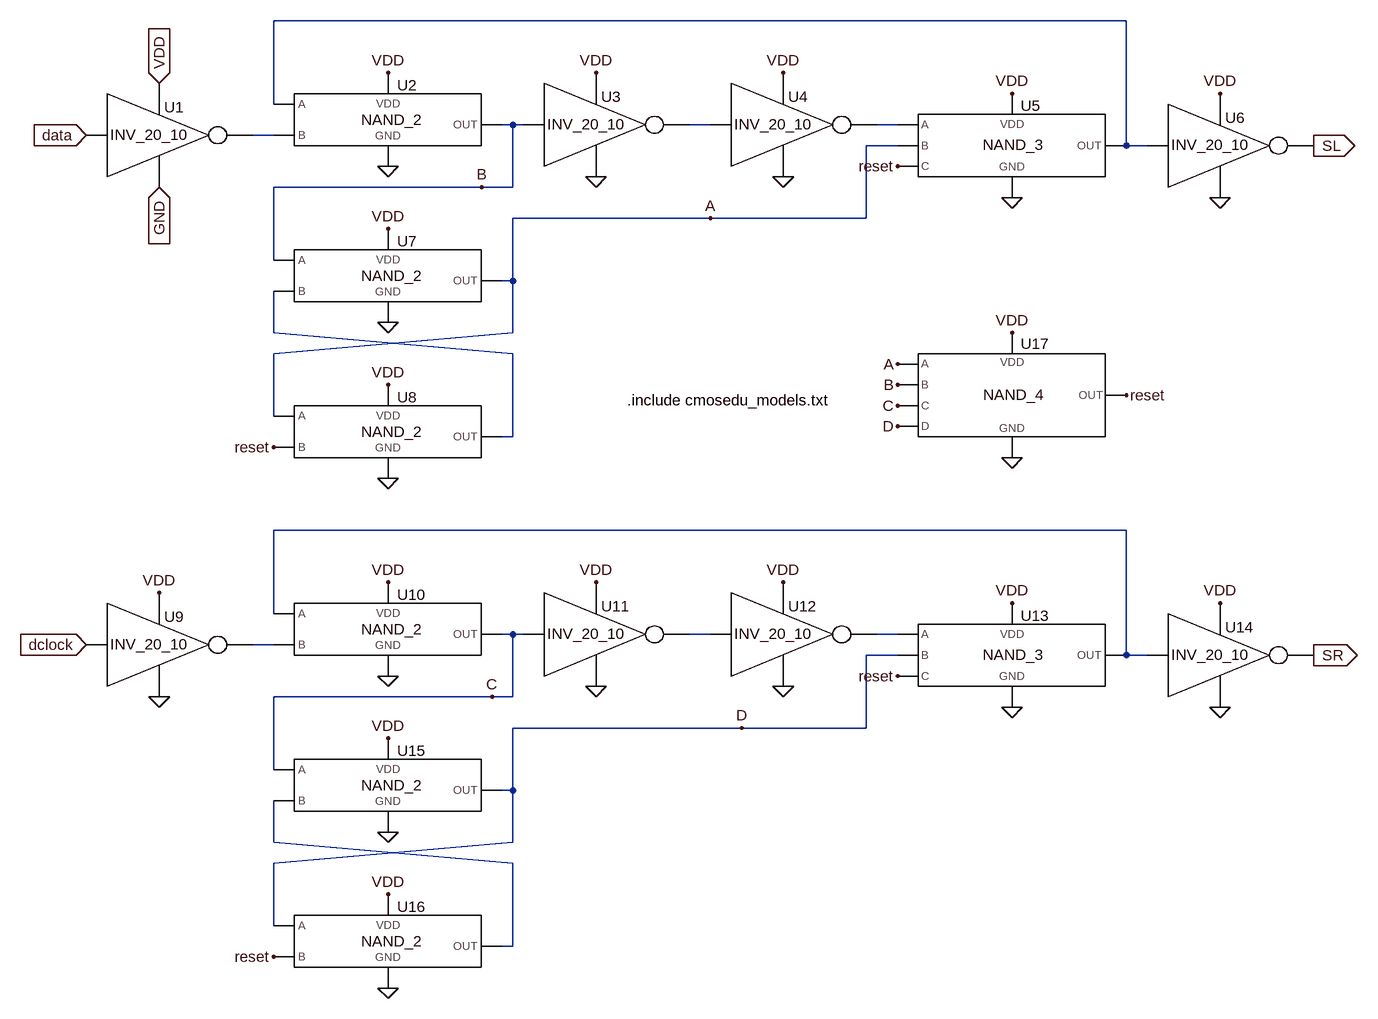
[diagram p0: schematic PD_RSDLL.asc]
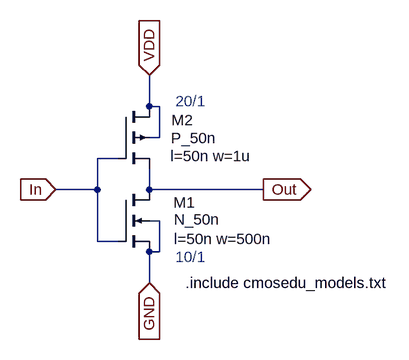
[diagram p1: sub-circuit inv_20_10.asc]
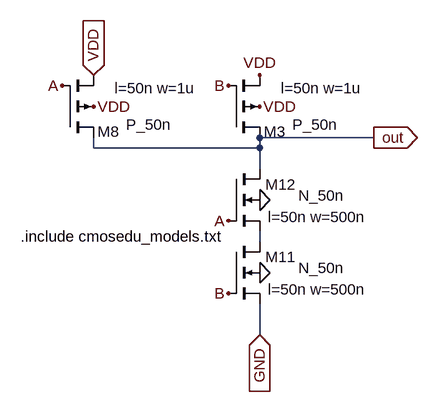
[diagram p2: sub-circuit nand_2.asc]
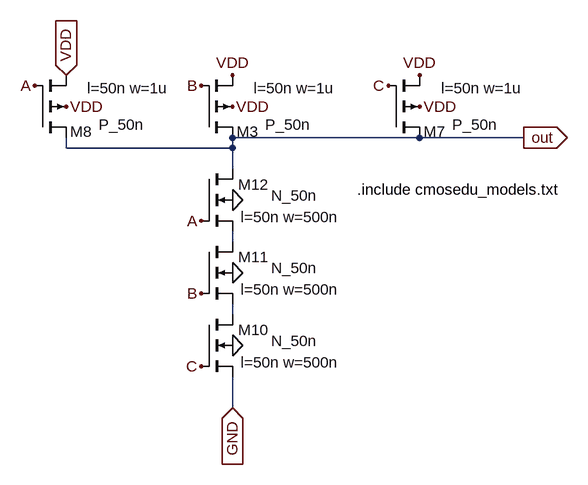
[diagram p3: sub-circuit nand_3.asc]
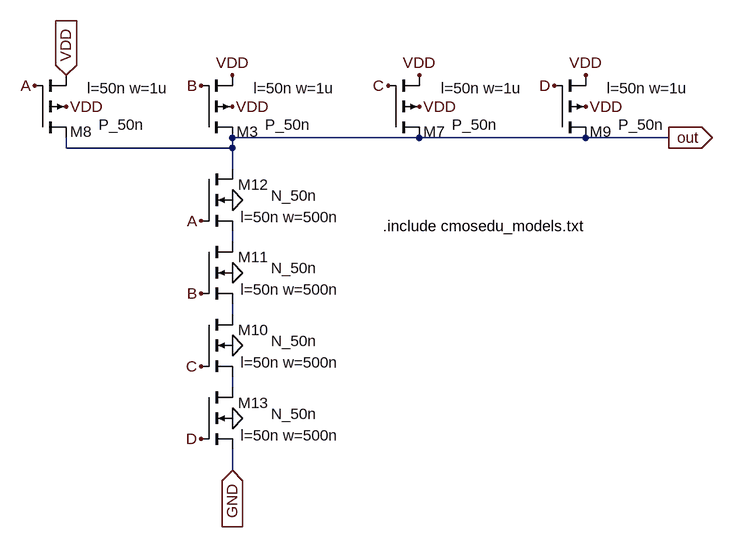
[diagram p4: sub-circuit nand_4.asc]
PD_RSDLL.asc, the LTspice schematic file:
Version 4
SHEET 1 6296 1412
WIRE 2592 -96 1280 -96
WIRE 1280 32 1280 -96
WIRE 1648 64 1632 64
WIRE 1664 64 1648 64
WIRE 1952 64 1920 64
WIRE 2240 64 2208 64
WIRE 1280 80 1248 80
WIRE 2240 96 2192 96
WIRE 2592 96 2592 -96
WIRE 2624 96 2592 96
WIRE 1600 160 1280 160
WIRE 1648 160 1648 64
WIRE 1648 160 1600 160
WIRE 1952 208 1648 208
WIRE 2192 208 2192 96
WIRE 2192 208 1952 208
WIRE 1280 272 1280 160
WIRE 1648 304 1648 208
WIRE 1648 304 1632 304
WIRE 1280 384 1280 320
WIRE 1648 384 1648 304
WIRE 1280 416 1648 384
WIRE 1648 416 1280 384
WIRE 1280 512 1280 416
WIRE 1648 544 1648 416
WIRE 1648 544 1632 544
WIRE 2592 688 1280 688
WIRE 1280 816 1280 688
WIRE 1648 848 1632 848
WIRE 1664 848 1648 848
WIRE 1952 848 1920 848
WIRE 2240 848 2208 848
WIRE 1280 864 1248 864
WIRE 2240 880 2192 880
WIRE 2592 880 2592 688
WIRE 2624 880 2592 880
WIRE 1616 944 1280 944
WIRE 1648 944 1648 848
WIRE 1648 944 1616 944
WIRE 2000 992 1648 992
WIRE 2192 992 2192 880
WIRE 2192 992 2000 992
WIRE 1280 1056 1280 944
WIRE 1648 1088 1648 992
WIRE 1648 1088 1632 1088
WIRE 1280 1168 1280 1104
WIRE 1648 1168 1648 1088
WIRE 1280 1200 1648 1168
WIRE 1648 1200 1280 1168
WIRE 1280 1296 1280 1200
WIRE 1648 1328 1648 1200
WIRE 1648 1328 1632 1328
FLAG 1104 0 VDD
IOPIN 1104 0 In
FLAG 992 80 data
IOPIN 992 80 In
FLAG 1456 -16 VDD
FLAG 1456 128 0
FLAG 1776 144 0
FLAG 2064 144 0
FLAG 2416 16 VDD
FLAG 1776 -16 VDD
FLAG 2064 -16 VDD
FLAG 2416 176 0
FLAG 2736 176 0
FLAG 2736 16 VDD
FLAG 2880 96 SL
IOPIN 2880 96 Out
FLAG 1456 368 0
FLAG 1456 608 0
FLAG 1456 224 VDD
FLAG 1456 464 VDD
FLAG 1280 560 reset
FLAG 1104 160 GND
IOPIN 1104 160 In
FLAG 992 864 dclock
IOPIN 992 864 In
FLAG 1456 768 VDD
FLAG 1456 912 0
FLAG 1776 928 0
FLAG 2064 928 0
FLAG 2416 800 VDD
FLAG 1776 768 VDD
FLAG 2064 768 VDD
FLAG 2416 960 0
FLAG 2736 960 0
FLAG 2736 800 VDD
FLAG 2880 880 SR
IOPIN 2880 880 Out
FLAG 1456 1152 0
FLAG 1456 1392 0
FLAG 1456 1008 VDD
FLAG 1456 1248 VDD
FLAG 1280 1344 reset
FLAG 1104 944 0
FLAG 1104 784 VDD
FLAG 2240 128 reset
FLAG 2240 912 reset
FLAG 2592 480 reset
FLAG 2416 576 0
FLAG 2416 384 VDD
FLAG 1952 208 A
FLAG 1600 160 B
FLAG 1616 944 C
FLAG 2240 496 C
FLAG 2240 432 A
FLAG 2240 464 B
FLAG 2000 992 D
FLAG 2240 528 D
SYMBOL INV_20_10 1024 16 R0
SYMATTR InstName U1
SYMBOL NAND_2 1232 80 R0
SYMATTR InstName U2
SYMBOL INV_20_10 1696 0 R0
SYMATTR InstName U3
SYMBOL INV_20_10 1984 0 R0
SYMATTR InstName U4
SYMBOL NAND_3 2192 112 R0
SYMATTR InstName U5
SYMBOL INV_20_10 2656 32 R0
SYMATTR InstName U6
SYMBOL NAND_2 1232 320 R0
SYMATTR InstName U7
SYMBOL NAND_2 1232 560 R0
SYMATTR InstName U8
SYMBOL INV_20_10 1024 800 R0
SYMATTR InstName U9
SYMBOL NAND_2 1232 864 R0
SYMATTR InstName U10
SYMBOL INV_20_10 1696 784 R0
SYMATTR InstName U11
SYMBOL INV_20_10 1984 784 R0
SYMATTR InstName U12
SYMBOL NAND_3 2192 896 R0
SYMATTR InstName U13
SYMBOL INV_20_10 2656 816 R0
SYMATTR InstName U14
SYMBOL NAND_2 1232 1104 R0
SYMATTR InstName U15
SYMBOL NAND_2 1232 1344 R0
SYMATTR InstName U16
SYMBOL NAND_4 2192 480 R0
SYMATTR InstName U17
TEXT 1824 488 Left 0 !.include cmosedu_models.txt

inv_20_10.asc, the sub-circuit schematic file:
Version 4
SHEET 1 1136 680
WIRE 448 -304 448 -352
WIRE 464 -304 448 -304
WIRE 464 -256 464 -304
WIRE 464 -256 448 -256
WIRE 400 -224 368 -224
WIRE 368 -176 368 -224
WIRE 368 -176 304 -176
WIRE 448 -176 448 -208
WIRE 624 -176 448 -176
WIRE 464 -128 448 -128
WIRE 368 -96 368 -176
WIRE 400 -96 368 -96
WIRE 464 -80 464 -128
WIRE 464 -80 448 -80
WIRE 448 -32 448 -80
FLAG 304 -176 In
IOPIN 304 -176 In
FLAG 448 -352 VDD
IOPIN 448 -352 In
FLAG 448 -32 GND
IOPIN 448 -32 In
FLAG 624 -176 Out
IOPIN 624 -176 Out
SYMBOL nmos4 400 -176 R0
WINDOW 0 119 20 Right 0
WINDOW 3 157 46 Right 0
WINDOW 123 238 76 Right 0
SYMATTR InstName M1
SYMATTR Value N_50n
SYMATTR Value2 l=50n w=500n
SYMBOL pmos4 400 -304 R0
WINDOW 0 116 21 Right 0
WINDOW 3 151 49 Right 0
WINDOW 123 206 76 Right 0
SYMATTR InstName M2
SYMATTR Value P_50n
SYMATTR Value2 l=50n w=1u
TEXT 488 -312 Left 0 ;20/1
TEXT 488 -72 Left 0 ;10/1
TEXT 504 -32 Left 0 !.include cmosedu_models.txt

nand_2.asc, the sub-circuit schematic file:
Version 4
SHEET 1 6288 680
WIRE 1344 -416 1168 -416
WIRE 912 -400 912 -416
WIRE 1168 -400 1168 -416
WIRE 1168 -400 912 -400
WIRE 1168 -368 1168 -400
WIRE 1168 -256 1168 -272
WIRE 1168 -112 1168 -160
FLAG 1168 -464 VDD
FLAG 912 -464 VDD
FLAG 1168 -208 0
FLAG 1168 -320 0
FLAG 1168 -512 VDD
FLAG 912 -512 VDD
IOPIN 912 -512 In
FLAG 1168 -112 GND
IOPIN 1168 -112 In
FLAG 1344 -416 out
IOPIN 1344 -416 Out
FLAG 864 -496 A
FLAG 1120 -288 A
FLAG 1120 -496 B
FLAG 1120 -176 B
SYMBOL pmos4 1120 -416 M180
WINDOW 0 88 9 Right 0
WINDOW 3 168 20 Right 0
WINDOW 123 206 76 Right 0
SYMATTR InstName M3
SYMATTR Value P_50n
SYMATTR Value2 l=50n w=1u
SYMBOL pmos4 864 -416 M180
WINDOW 0 88 9 Right 0
WINDOW 3 168 20 Right 0
WINDOW 123 206 76 Right 0
SYMATTR InstName M8
SYMATTR Value P_50n
SYMATTR Value2 l=50n w=1u
SYMBOL nmos4 1120 -256 R0
WINDOW 0 104 24 Right 0
WINDOW 3 179 41 Right 0
WINDOW 123 213 74 Right 0
SYMATTR InstName M11
SYMATTR Value N_50n
SYMATTR Value2 l=50n w=500n
SYMBOL nmos4 1120 -368 R0
WINDOW 0 104 24 Right 0
WINDOW 3 179 41 Right 0
WINDOW 123 213 74 Right 0
SYMATTR InstName M12
SYMATTR Value N_50n
SYMATTR Value2 l=50n w=500n
TEXT 800 -264 Left 0 !.include cmosedu_models.txt

nand_3.asc, the sub-circuit schematic file:
Version 4
SHEET 1 6288 680
WIRE 1456 -416 1168 -416
WIRE 1616 -416 1456 -416
WIRE 912 -400 912 -416
WIRE 1168 -400 1168 -416
WIRE 1168 -400 912 -400
WIRE 1168 -368 1168 -400
WIRE 1168 -256 1168 -272
WIRE 1168 -144 1168 -160
WIRE 1168 0 1168 -48
FLAG 1168 -464 VDD
FLAG 1456 -464 VDD
FLAG 912 -464 VDD
FLAG 1168 -96 0
FLAG 1168 -208 0
FLAG 1168 -320 0
FLAG 1168 -512 VDD
FLAG 1456 -512 VDD
FLAG 912 -512 VDD
IOPIN 912 -512 In
FLAG 1168 0 GND
IOPIN 1168 0 In
FLAG 1616 -416 out
IOPIN 1616 -416 Out
FLAG 864 -496 A
FLAG 1120 -288 A
FLAG 1120 -496 B
FLAG 1120 -176 B
FLAG 1408 -496 C
FLAG 1120 -64 C
SYMBOL pmos4 1120 -416 M180
WINDOW 0 88 9 Right 0
WINDOW 3 168 20 Right 0
WINDOW 123 206 76 Right 0
SYMATTR InstName M3
SYMATTR Value P_50n
SYMATTR Value2 l=50n w=1u
SYMBOL pmos4 1408 -416 M180
WINDOW 0 88 9 Right 0
WINDOW 3 168 20 Right 0
WINDOW 123 206 76 Right 0
SYMATTR InstName M7
SYMATTR Value P_50n
SYMATTR Value2 l=50n w=1u
SYMBOL pmos4 864 -416 M180
WINDOW 0 88 9 Right 0
WINDOW 3 168 20 Right 0
WINDOW 123 206 76 Right 0
SYMATTR InstName M8
SYMATTR Value P_50n
SYMATTR Value2 l=50n w=1u
SYMBOL nmos4 1120 -144 R0
WINDOW 0 104 24 Right 0
WINDOW 3 179 41 Right 0
WINDOW 123 213 74 Right 0
SYMATTR InstName M10
SYMATTR Value N_50n
SYMATTR Value2 l=50n w=500n
SYMBOL nmos4 1120 -256 R0
WINDOW 0 104 24 Right 0
WINDOW 3 179 41 Right 0
WINDOW 123 213 74 Right 0
SYMATTR InstName M11
SYMATTR Value N_50n
SYMATTR Value2 l=50n w=500n
SYMBOL nmos4 1120 -368 R0
WINDOW 0 104 24 Right 0
WINDOW 3 179 41 Right 0
WINDOW 123 213 74 Right 0
SYMATTR InstName M12
SYMATTR Value N_50n
SYMATTR Value2 l=50n w=500n
TEXT 1360 -336 Left 0 !.include cmosedu_models.txt

nand_4.asc, the sub-circuit schematic file:
Version 4
SHEET 1 6288 680
WIRE 1456 -416 1168 -416
WIRE 1712 -416 1456 -416
WIRE 1840 -416 1712 -416
WIRE 912 -400 912 -416
WIRE 1168 -400 1168 -416
WIRE 1168 -400 912 -400
WIRE 1168 -368 1168 -400
WIRE 1168 -256 1168 -272
WIRE 1168 -144 1168 -160
WIRE 1168 -32 1168 -48
WIRE 1168 96 1168 64
FLAG 1168 -464 VDD
FLAG 1456 -464 VDD
FLAG 912 -464 VDD
FLAG 1712 -464 VDD
FLAG 1168 -96 0
FLAG 1168 -208 0
FLAG 1168 -320 0
FLAG 1168 16 0
FLAG 1168 -512 VDD
FLAG 1456 -512 VDD
FLAG 1712 -512 VDD
FLAG 912 -512 VDD
IOPIN 912 -512 In
FLAG 1168 96 GND
IOPIN 1168 96 In
FLAG 1840 -416 out
IOPIN 1840 -416 Out
FLAG 864 -496 A
FLAG 1120 -288 A
FLAG 1120 -496 B
FLAG 1120 -176 B
FLAG 1408 -496 C
FLAG 1120 -64 C
FLAG 1664 -496 D
FLAG 1120 48 D
SYMBOL pmos4 1120 -416 M180
WINDOW 0 88 9 Right 0
WINDOW 3 168 20 Right 0
WINDOW 123 206 76 Right 0
SYMATTR InstName M3
SYMATTR Value P_50n
SYMATTR Value2 l=50n w=1u
SYMBOL pmos4 1408 -416 M180
WINDOW 0 88 9 Right 0
WINDOW 3 168 20 Right 0
WINDOW 123 206 76 Right 0
SYMATTR InstName M7
SYMATTR Value P_50n
SYMATTR Value2 l=50n w=1u
SYMBOL pmos4 864 -416 M180
WINDOW 0 88 9 Right 0
WINDOW 3 168 20 Right 0
WINDOW 123 206 76 Right 0
SYMATTR InstName M8
SYMATTR Value P_50n
SYMATTR Value2 l=50n w=1u
SYMBOL pmos4 1664 -416 M180
WINDOW 0 88 9 Right 0
WINDOW 3 168 20 Right 0
WINDOW 123 206 76 Right 0
SYMATTR InstName M9
SYMATTR Value P_50n
SYMATTR Value2 l=50n w=1u
SYMBOL nmos4 1120 -144 R0
WINDOW 0 104 24 Right 0
WINDOW 3 179 41 Right 0
WINDOW 123 213 74 Right 0
SYMATTR InstName M10
SYMATTR Value N_50n
SYMATTR Value2 l=50n w=500n
SYMBOL nmos4 1120 -256 R0
WINDOW 0 104 24 Right 0
WINDOW 3 179 41 Right 0
WINDOW 123 213 74 Right 0
SYMATTR InstName M11
SYMATTR Value N_50n
SYMATTR Value2 l=50n w=500n
SYMBOL nmos4 1120 -368 R0
WINDOW 0 104 24 Right 0
WINDOW 3 179 41 Right 0
WINDOW 123 213 74 Right 0
SYMATTR InstName M12
SYMATTR Value N_50n
SYMATTR Value2 l=50n w=500n
SYMBOL nmos4 1120 -32 R0
WINDOW 0 104 24 Right 0
WINDOW 3 179 41 Right 0
WINDOW 123 213 74 Right 0
SYMATTR InstName M13
SYMATTR Value N_50n
SYMATTR Value2 l=50n w=500n
TEXT 1400 -280 Left 0 !.include cmosedu_models.txt

The netlist it stands for:
* PD_RSDLL.asc
XU1 data N004 VDD GND inv_20_10 params: INV_20_10
XU2 N001 N004 B VDD 0 nand_2 params: NAND_2
XU3 B N002 VDD 0 inv_20_10 params: INV_20_10
XU4 N002 N003 VDD 0 inv_20_10 params: INV_20_10
XU5 N003 A reset N001 VDD 0 nand_3 params: NAND_3
XU6 N001 SL VDD 0 inv_20_10 params: INV_20_10
XU7 B N005 A VDD 0 nand_2 params: NAND_2
XU8 A reset N005 VDD 0 nand_2 params: NAND_2
XU9 dclock N009 VDD 0 inv_20_10 params: INV_20_10
XU10 N006 N009 C VDD 0 nand_2 params: NAND_2
XU11 C N007 VDD 0 inv_20_10 params: INV_20_10
XU12 N007 N008 VDD 0 inv_20_10 params: INV_20_10
XU13 N008 D reset N006 VDD 0 nand_3 params: NAND_3
XU14 N006 SR VDD 0 inv_20_10 params: INV_20_10
XU15 C N010 D VDD 0 nand_2 params: NAND_2
XU16 D reset N010 VDD 0 nand_2 params: NAND_2
XU17 A B C D reset VDD 0 nand_4 params: NAND_4

* block symbol definitions
.subckt inv_20_10 In Out VDD GND
M1 Out In GND GND N_50n l=50n w=500n
M2 VDD In Out VDD P_50n l=50n w=1u
* 20/1
* 10/1
.include cmosedu_models.txt
.ends inv_20_10

.subckt nand_2 A B OUT VDD GND
M3 out B VDD VDD P_50n l=50n w=1u
M8 out A VDD VDD P_50n l=50n w=1u
M11 N001 B GND 0 N_50n l=50n w=500n
M12 out A N001 0 N_50n l=50n w=500n
.include cmosedu_models.txt
.ends nand_2

.subckt nand_3 A B C OUT VDD GND
M3 out B VDD VDD P_50n l=50n w=1u
M7 out C VDD VDD P_50n l=50n w=1u
M8 out A VDD VDD P_50n l=50n w=1u
M10 N002 C GND 0 N_50n l=50n w=500n
M11 N001 B N002 0 N_50n l=50n w=500n
M12 out A N001 0 N_50n l=50n w=500n
.include cmosedu_models.txt
.ends nand_3

.subckt nand_4 A B C D OUT VDD GND
M3 out B VDD VDD P_50n l=50n w=1u
M7 out C VDD VDD P_50n l=50n w=1u
M8 out A VDD VDD P_50n l=50n w=1u
M9 out D VDD VDD P_50n l=50n w=1u
M10 N002 C N003 0 N_50n l=50n w=500n
M11 N001 B N002 0 N_50n l=50n w=500n
M12 out A N001 0 N_50n l=50n w=500n
M13 N003 D GND 0 N_50n l=50n w=500n
.include cmosedu_models.txt
.ends nand_4

.model NMOS NMOS
.model PMOS PMOS
.lib standard.mos
.include cmosedu_models.txt
.backanno
.end